# Altium schematic sheet USST_ARM.SchDoc
size A4
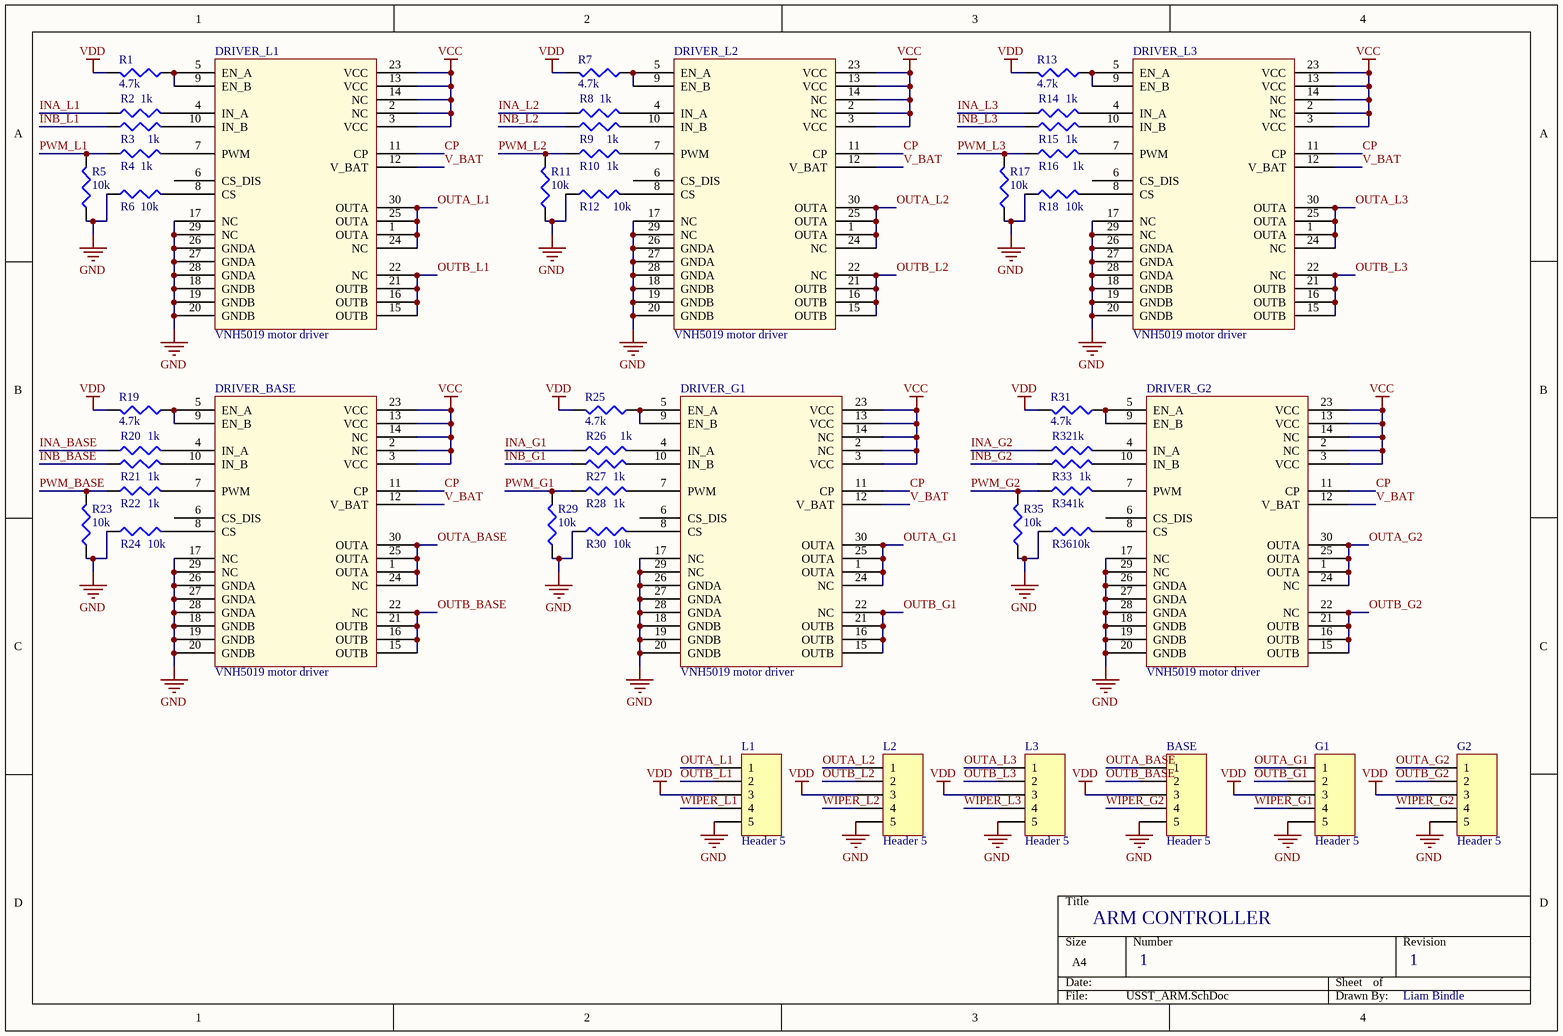
[diagram p0: USST_ARM.SchDoc]

## Parts
BASE  Header 5  [HDR1X5]
DRIVER_BASE  VNH5019 motor driver  [VNH5019_USST]
DRIVER_G1  VNH5019 motor driver  [VNH5019_USST]
DRIVER_G2  VNH5019 motor driver  [VNH5019_USST]
DRIVER_L1  VNH5019 motor driver  [VNH5019_USST]
DRIVER_L2  VNH5019 motor driver  [VNH5019_USST]
DRIVER_L3  VNH5019 motor driver  [VNH5019_USST]
G1  Header 5  [HDR1X5]
G2  Header 5  [HDR1X5]
L1  Header 5  [HDR1X5]
L2  Header 5  [HDR1X5]
L3  Header 5  [HDR1X5]
R1  value 4.7k  [J1-0603]  (hidden comment: Res3)
R2  value 1k  [J1-0603]  (hidden comment: Res3)
R3  value 1k  [J1-0603]  (hidden comment: Res3)
R4  value 1k  [J1-0603]  (hidden comment: Res3)
R5  value 10k  [J1-0603]  (hidden comment: Res3)
R6  value 10k  [J1-0603]  (hidden comment: Res3)
R7  value 4.7k  [J1-0603]  (hidden comment: Res3)
R8  value 1k  [J1-0603]  (hidden comment: Res3)
R9  value 1k  [J1-0603]  (hidden comment: Res3)
R10  value 1k  [J1-0603]  (hidden comment: Res3)
R11  value 10k  [J1-0603]  (hidden comment: Res3)
R12  value 10k  [J1-0603]  (hidden comment: Res3)
R13  value 4.7k  [J1-0603]  (hidden comment: Res3)
R14  value 1k  [J1-0603]  (hidden comment: Res3)
R15  value 1k  [J1-0603]  (hidden comment: Res3)
R16  value 1k  [J1-0603]  (hidden comment: Res3)
R17  value 10k  [J1-0603]  (hidden comment: Res3)
R18  value 10k  [J1-0603]  (hidden comment: Res3)
R19  value 4.7k  [J1-0603]  (hidden comment: Res3)
R20  value 1k  [J1-0603]  (hidden comment: Res3)
R21  value 1k  [J1-0603]  (hidden comment: Res3)
R22  value 1k  [J1-0603]  (hidden comment: Res3)
R23  value 10k  [J1-0603]  (hidden comment: Res3)
R24  value 10k  [J1-0603]  (hidden comment: Res3)
R25  value 4.7k  [J1-0603]  (hidden comment: Res3)
R26  value 1k  [J1-0603]  (hidden comment: Res3)
R27  value 1k  [J1-0603]  (hidden comment: Res3)
R28  value 1k  [J1-0603]  (hidden comment: Res3)
R29  value 10k  [J1-0603]  (hidden comment: Res3)
R30  value 10k  [J1-0603]  (hidden comment: Res3)
R31  value 4.7k  [J1-0603]  (hidden comment: Res3)
R32  value 1k  [J1-0603]  (hidden comment: Res3)
R33  value 1k  [J1-0603]  (hidden comment: Res3)
R34  value 1k  [J1-0603]  (hidden comment: Res3)
R35  value 10k  [J1-0603]  (hidden comment: Res3)
R36  value 10k  [J1-0603]  (hidden comment: Res3)

## Nets
GND: BASE.5 DRIVER_BASE.17(NC) DRIVER_BASE.18(GNDB) DRIVER_BASE.19(GNDB) DRIVER_BASE.20(GNDB) DRIVER_BASE.26(GNDA) DRIVER_BASE.27(GNDA) DRIVER_BASE.28(GNDA) DRIVER_BASE.29(NC) DRIVER_G1.17(NC) DRIVER_G1.18(GNDB) DRIVER_G1.19(GNDB) DRIVER_G1.20(GNDB) DRIVER_G1.26(GNDA) DRIVER_G1.27(GNDA) DRIVER_G1.28(GNDA) DRIVER_G1.29(NC) DRIVER_G2.17(NC) DRIVER_G2.18(GNDB) DRIVER_G2.19(GNDB) DRIVER_G2.20(GNDB) DRIVER_G2.26(GNDA) DRIVER_G2.27(GNDA) DRIVER_G2.28(GNDA) DRIVER_G2.29(NC) DRIVER_L1.17(NC) DRIVER_L1.18(GNDB) DRIVER_L1.19(GNDB) DRIVER_L1.20(GNDB) DRIVER_L1.26(GNDA) DRIVER_L1.27(GNDA) DRIVER_L1.28(GNDA) DRIVER_L1.29(NC) DRIVER_L2.17(NC) DRIVER_L2.18(GNDB) DRIVER_L2.19(GNDB) DRIVER_L2.20(GNDB) DRIVER_L2.26(GNDA) DRIVER_L2.27(GNDA) DRIVER_L2.28(GNDA) DRIVER_L2.29(NC) DRIVER_L3.17(NC) DRIVER_L3.18(GNDB) DRIVER_L3.19(GNDB) DRIVER_L3.20(GNDB) DRIVER_L3.26(GNDA) DRIVER_L3.27(GNDA) DRIVER_L3.28(GNDA) DRIVER_L3.29(NC) G1.5 G2.5 L1.5 L2.5 L3.5 R5.1 R6.1 R11.1 R12.1 R17.1 R18.1 R23.1 R24.1 R29.1 R30.1 R35.1 R36.1
VCC: DRIVER_BASE.2(NC) DRIVER_BASE.3(VCC) DRIVER_BASE.13(VCC) DRIVER_BASE.14(NC) DRIVER_BASE.23(VCC) DRIVER_G1.2(NC) DRIVER_G1.3(VCC) DRIVER_G1.13(VCC) DRIVER_G1.14(NC) DRIVER_G1.23(VCC) DRIVER_G2.2(NC) DRIVER_G2.3(VCC) DRIVER_G2.13(VCC) DRIVER_G2.14(NC) DRIVER_G2.23(VCC) DRIVER_L1.2(NC) DRIVER_L1.3(VCC) DRIVER_L1.13(VCC) DRIVER_L1.14(NC) DRIVER_L1.23(VCC) DRIVER_L2.2(NC) DRIVER_L2.3(VCC) DRIVER_L2.13(VCC) DRIVER_L2.14(NC) DRIVER_L2.23(VCC) DRIVER_L3.2(NC) DRIVER_L3.3(VCC) DRIVER_L3.13(VCC) DRIVER_L3.14(NC) DRIVER_L3.23(VCC)
VDD: BASE.3 G1.3 G2.3 L1.3 L2.3 L3.3 R1.2 R7.2 R13.2 R19.2 R25.2 R31.2
CP: DRIVER_BASE.11(CP) DRIVER_G1.11(CP) DRIVER_G2.11(CP) DRIVER_L1.11(CP) DRIVER_L2.11(CP) DRIVER_L3.11(CP)
INA_BASE: R20.1
INA_G1: R26.1
INA_G2: R32.1
INA_L1: R2.1
INA_L2: R8.1
INA_L3: R14.1
INB_BASE: R21.1
INB_G1: R27.1
INB_G2: R33.1
INB_L1: R3.1
INB_L2: R9.1
INB_L3: R15.1
OUTA_BASE: BASE.1 DRIVER_BASE.1(OUTA) DRIVER_BASE.24(NC) DRIVER_BASE.25(OUTA) DRIVER_BASE.30(OUTA)
OUTA_G1: DRIVER_G1.1(OUTA) DRIVER_G1.24(NC) DRIVER_G1.25(OUTA) DRIVER_G1.30(OUTA) G1.1
OUTA_G2: DRIVER_G2.1(OUTA) DRIVER_G2.24(NC) DRIVER_G2.25(OUTA) DRIVER_G2.30(OUTA) G2.1
OUTA_L1: DRIVER_L1.1(OUTA) DRIVER_L1.24(NC) DRIVER_L1.25(OUTA) DRIVER_L1.30(OUTA) L1.1
OUTA_L2: DRIVER_L2.1(OUTA) DRIVER_L2.24(NC) DRIVER_L2.25(OUTA) DRIVER_L2.30(OUTA) L2.1
OUTA_L3: DRIVER_L3.1(OUTA) DRIVER_L3.24(NC) DRIVER_L3.25(OUTA) DRIVER_L3.30(OUTA) L3.1
OUTB_BASE: BASE.2 DRIVER_BASE.15(OUTB) DRIVER_BASE.16(OUTB) DRIVER_BASE.21(OUTB) DRIVER_BASE.22(NC)
OUTB_G1: DRIVER_G1.15(OUTB) DRIVER_G1.16(OUTB) DRIVER_G1.21(OUTB) DRIVER_G1.22(NC) G1.2
OUTB_G2: DRIVER_G2.15(OUTB) DRIVER_G2.16(OUTB) DRIVER_G2.21(OUTB) DRIVER_G2.22(NC) G2.2
OUTB_L1: DRIVER_L1.15(OUTB) DRIVER_L1.16(OUTB) DRIVER_L1.21(OUTB) DRIVER_L1.22(NC) L1.2
OUTB_L2: DRIVER_L2.15(OUTB) DRIVER_L2.16(OUTB) DRIVER_L2.21(OUTB) DRIVER_L2.22(NC) L2.2
OUTB_L3: DRIVER_L3.15(OUTB) DRIVER_L3.16(OUTB) DRIVER_L3.21(OUTB) DRIVER_L3.22(NC) L3.2
PWM_BASE: R22.1 R23.2
PWM_G1: R28.1 R29.2
PWM_G2: R34.1 R35.2
PWM_L1: R4.1 R5.2
PWM_L2: R10.1 R11.2
PWM_L3: R16.1 R17.2
V_BAT: DRIVER_BASE.12(V_BAT) DRIVER_G1.12(V_BAT) DRIVER_G2.12(V_BAT) DRIVER_L1.12(V_BAT) DRIVER_L2.12(V_BAT) DRIVER_L3.12(V_BAT)
WIPER_G1: G1.4
WIPER_G2: BASE.4 G2.4
WIPER_L1: L1.4
WIPER_L2: L2.4
WIPER_L3: L3.4
NetDRIVER_BASE_4: DRIVER_BASE.4(IN_A) R20.2
NetDRIVER_BASE_5: DRIVER_BASE.5(EN_A) DRIVER_BASE.9(EN_B) R19.1
NetDRIVER_BASE_7: DRIVER_BASE.7(PWM) R22.2
NetDRIVER_BASE_8: DRIVER_BASE.8(CS) R24.2
NetDRIVER_BASE_10: DRIVER_BASE.10(IN_B) R21.2
NetDRIVER_G1_4: DRIVER_G1.4(IN_A) R26.2
NetDRIVER_G1_5: DRIVER_G1.5(EN_A) DRIVER_G1.9(EN_B) R25.1
NetDRIVER_G1_7: DRIVER_G1.7(PWM) R28.2
NetDRIVER_G1_8: DRIVER_G1.8(CS) R30.2
NetDRIVER_G1_10: DRIVER_G1.10(IN_B) R27.2
NetDRIVER_G2_4: DRIVER_G2.4(IN_A) R32.2
NetDRIVER_G2_5: DRIVER_G2.5(EN_A) DRIVER_G2.9(EN_B) R31.1
NetDRIVER_G2_7: DRIVER_G2.7(PWM) R34.2
NetDRIVER_G2_8: DRIVER_G2.8(CS) R36.2
NetDRIVER_G2_10: DRIVER_G2.10(IN_B) R33.2
NetDRIVER_L1_4: DRIVER_L1.4(IN_A) R2.2
NetDRIVER_L1_5: DRIVER_L1.5(EN_A) DRIVER_L1.9(EN_B) R1.1
NetDRIVER_L1_7: DRIVER_L1.7(PWM) R4.2
NetDRIVER_L1_8: DRIVER_L1.8(CS) R6.2
NetDRIVER_L1_10: DRIVER_L1.10(IN_B) R3.2
NetDRIVER_L2_4: DRIVER_L2.4(IN_A) R8.2
NetDRIVER_L2_5: DRIVER_L2.5(EN_A) DRIVER_L2.9(EN_B) R7.1
NetDRIVER_L2_7: DRIVER_L2.7(PWM) R10.2
NetDRIVER_L2_8: DRIVER_L2.8(CS) R12.2
NetDRIVER_L2_10: DRIVER_L2.10(IN_B) R9.2
NetDRIVER_L3_4: DRIVER_L3.4(IN_A) R14.2
NetDRIVER_L3_5: DRIVER_L3.5(EN_A) DRIVER_L3.9(EN_B) R13.1
NetDRIVER_L3_7: DRIVER_L3.7(PWM) R16.2
NetDRIVER_L3_8: DRIVER_L3.8(CS) R18.2
NetDRIVER_L3_10: DRIVER_L3.10(IN_B) R15.2

Not connected (* = marked no-connect by the designer): DRIVER_BASE 6(CS_DIS); DRIVER_G1 6(CS_DIS); DRIVER_G2 6(CS_DIS); DRIVER_L1 6(CS_DIS); DRIVER_L2 6(CS_DIS); DRIVER_L3 6(CS_DIS)

## Notes on the sheet
- ARM CONTROLLER
- 1
- Liam Bindle

## Library data of the parts
BASE G1 G2 L1-L3 = Header 5: Header, 5-Pin; LatestRevisionDate: 17-Jul-2002; LatestRevisionNote: Re-released for DXP Platform.; Publisher: Altium Limited
DRIVER_BASE DRIVER_G1 DRIVER_G2 DRIVER_L1-DRIVER_L3 = Component_1: Motor driver
R1-R36 = Res3: Resistor; Published: 8-Jun-2000; LatestRevisionDate: 29-May-2009; LatestRevisionNote: IPC-7351 Footprint Added.; PackageReference: J1-0603; Publisher: Altium Limited; PackageDescription: Chip Resistor